# EAGLE design eib_v1.0 (EAGLE 5.06)
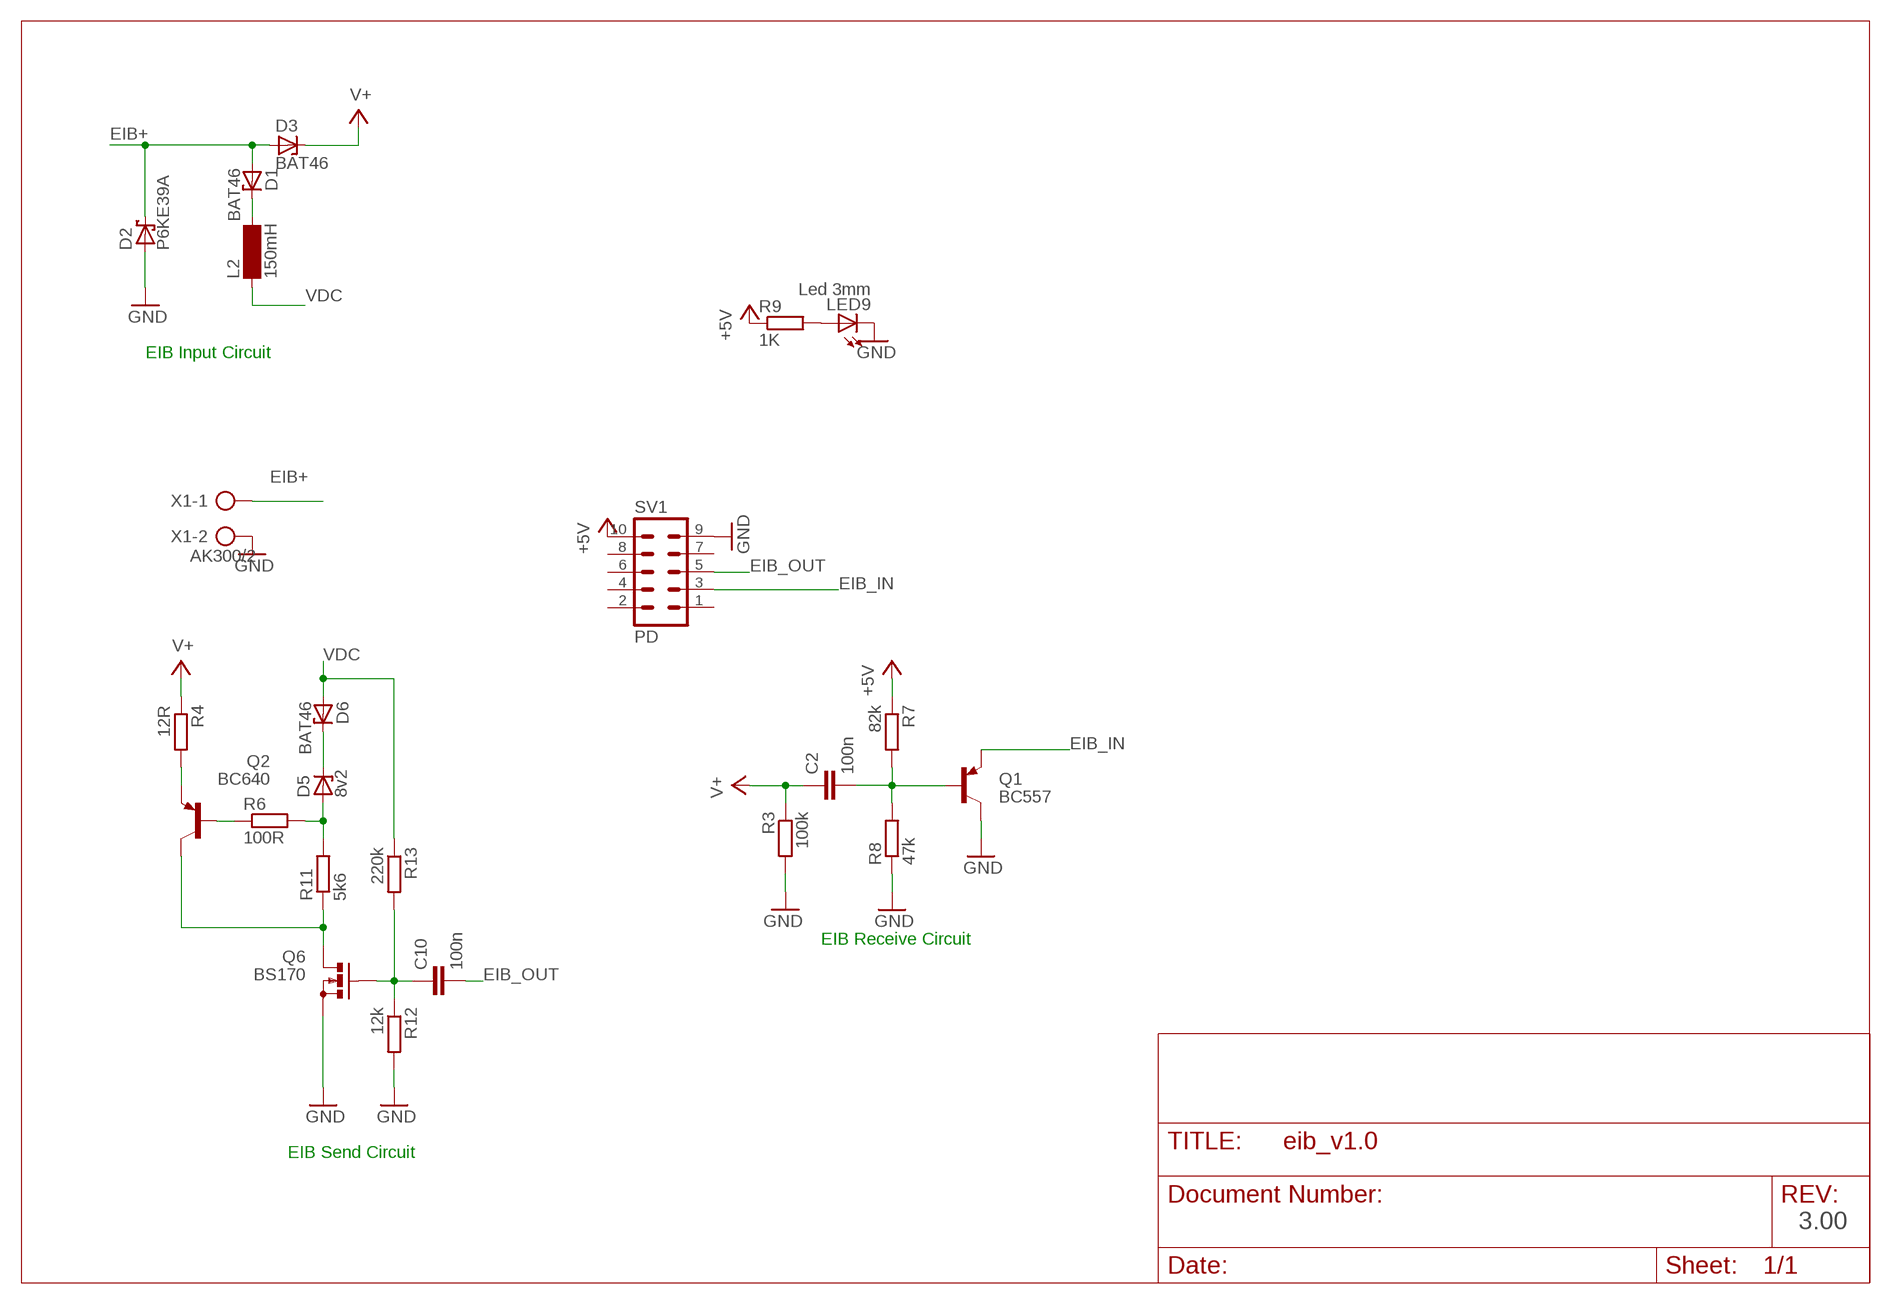
[diagram p0: schematic, sheet 1]

## Parts
C2  100n  C-EU050-025X075  [C050-025X075]
C10  100n  C-EU050-025X075  [C050-025X075]
D1  BAT46  1N821  [DO35Z10]
D2  P6KE39A  P6KEXXA  [C1702-15]
D3  BAT46  1N821  [DO35Z10]
D5  8v2  BZX90  [DO34Z7]
D6  BAT46  1N821  [DO35Z10]
L2  150mH  SD12-1000  [SD12_1000]
LED9  Led 3mm  LED3MM  [LED3MM]
Q1  BC557  [TO92]
Q2  BC640  [TO92-BCE]
Q6  BS170  [SOT54E]
R3  100k  R-EU_0207/10  [0207/10]
R4  12R  R-EU_0204/7  [0204/7]
R6  100R  R-EU_0204/2V  [0204V]
R7  82k  R-EU_0204/5  [0204/5]
R8  47k  R-EU_0204/2V  [0204V]
R9  1K  R-EU_0204/2V  [0204V]
R11  5k6  R-EU_0204/2V  [0204V]
R12  12k  R-EU_0204/7  [0204/7]
R13  220k  R-EU_0204/7  [0204/7]
SV1  PD  ML10  [ML10]
X1  AK300/2  [AK300/2]

## Nets
+5V: R7.1 R9.1 SV1.10
EIB+: D1.A D2.C D3.A X1.1
EIB_IN: Q1.1(E) SV1.3
EIB_OUT: C10.2 SV1.5
GND: D2.A LED9.K(C) Q1.3(C) Q6.S R3.2 R8.1 R12.2 SV1.9 X1.2
N$1: Q2.E R4.2
N$2: D5.C D6.C
N$3: C10.1 Q6.G R12.1 R13.2
N$4: Q2.B R6.1
N$5: Q2.C Q6.D R11.1
N$6: D1.C L2.2
N$7 [supply]: C2.2 Q1.2(B) R7.2 R8.2
N$10: D5.A R6.2 R11.2
N$25: LED9.A R9.2
V+: C2.1 D3.C R3.1 R4.1
VDC [supply]: D6.A L2.1 R13.1
Unconnected: SV1.1 SV1.2 SV1.4 SV1.6 SV1.7 SV1.8

## Notes on the sheet
- EIB Input Circuit
- EIB Receive Circuit
- EIB Send Circuit
- 3.00

## Library data of the parts
C2 C10 = rcl:C-EU: CAPACITOR, European symbol
D1 D3 D6 = diode:1N821: Reference DIODE temperature compensated, 6,2 V
D2 = diode:P6KEXXA: DIODE transient-voltage suppressor
D5 = diode:BZX90: Z DIODE
L2 = inductor-neosid:SD12: INDUCTOR nominal inductance
LED9 = led:LED: LED OSRAM: - CHIPLED LG R971, LG N971, LY N971, LG Q971, LY Q971, LO R971, LY R971 LH N974, LH R974 LS Q976, LO Q976, LY Q976 LO Q996 - Hyper CHIPLED LW Q18S LB Q993, LB Q99A, LB R99A - SideLED LS A670, LO A670, LY A670, LG A670, LP A670 LB A673, LV A673, LT A673, LW A673 LH A674 LY A675 LS A676, LA A676, LO A676, LY A676, LW A676 LS A679, LY A679, LG A679 - Hyper Micro SIDELED® LS Y876, LA Y876, LO Y876, LY Y876 LT Y87S - SmartLED LW L88C, LW L88S LB L89C, LB L89S, LG L890 LS L89K, LO L89K, LY L89K LS L896, LA L896, LO L896, LY L896 - TOPLED LS T670, LO T670, LY T670, LG T670, LP T670 LSG T670, LSP T670, LSY T670, LOP T670, LYG T670 LG T671, LOG T671, LSG T671 LB T673, LV T673, LT T673, LW T673 LH T674 LS T676, LA T676, LO T676, LY T676, LB T676, LH T676, LSB T676, LW T676 LB T67C, LV T67C, LT T67C, LS T67K, LO T67K, LY T67K, LW E67C LS E67B, LA E67B, LO E67B, LY E67B, LB E67C, LV E67C, LT E67C LW T67C LS T679, LY T679, LG T679 LS T770, LO T770, LY T770, LG T770, LP T770 LB T773, LV T773, LT T773, LW T773 LH T774 LS E675, LA E675, LY E675, LS T675 LS T776, LA T776, LO T776, LY T776, LB T776 LHGB T686 LT T68C, LB T68C - Hyper Mini TOPLED® LB M676 - Mini TOPLED Santana® LG M470 LS M47K, LO M47K, LY M47K Source: http://www.osram.convergy.de LUXEON: - LUMILED® LXK2-PW12-R00, LXK2-PW12-S00, LXK2-PW14-U00, LXK2-PW14-V00 LXK2-PM12-R00, LXK2-PM12-S00, LXK2-PM14-U00 LXK2-PE12-Q00, LXK2-PE12-R00, LXK2-PE12-S00, LXK2-PE14-T00, LXK2-PE14-U00 LXK2-PB12-K00, LXK2-PB12-L00, LXK2-PB12-M00, LXK2-PB14-N00, LXK2-PB14-P00, LXK2-PB14-Q00 LXK2-PR12-L00, LXK2-PR12-M00, LXK2-PR14-Q00, LXK2-PR14-R00 LXK2-PD12-Q00, LXK2-PD12-R00, LXK2-PD12-S00 LXK2-PH12-R00, LXK2-PH12-S00 LXK2-PL12-P00, LXK2-PL12-Q00, LXK2-PL12-R00 Source: www.luxeon.com KINGBRIGHT: KA-3528ASYC Source: www.kingbright.com
Q1 = transistor-pnp:BC557: PNP Transistor
Q2 = transistor-pnp:BC640*: PNP Transistror
Q6 = transistor-small-signal:BS170: N-CHANNEL MOS FET
R3 R4 R6-R9 R11-R13 = rcl:R-EU_: RESISTOR, European symbol
SV1 = con-harting-ml:ML10: HARTING
X1 = con-ptr500:AK300/2: CONNECTOR

## Net classes
1 supply: width 0.406 mm

## Board
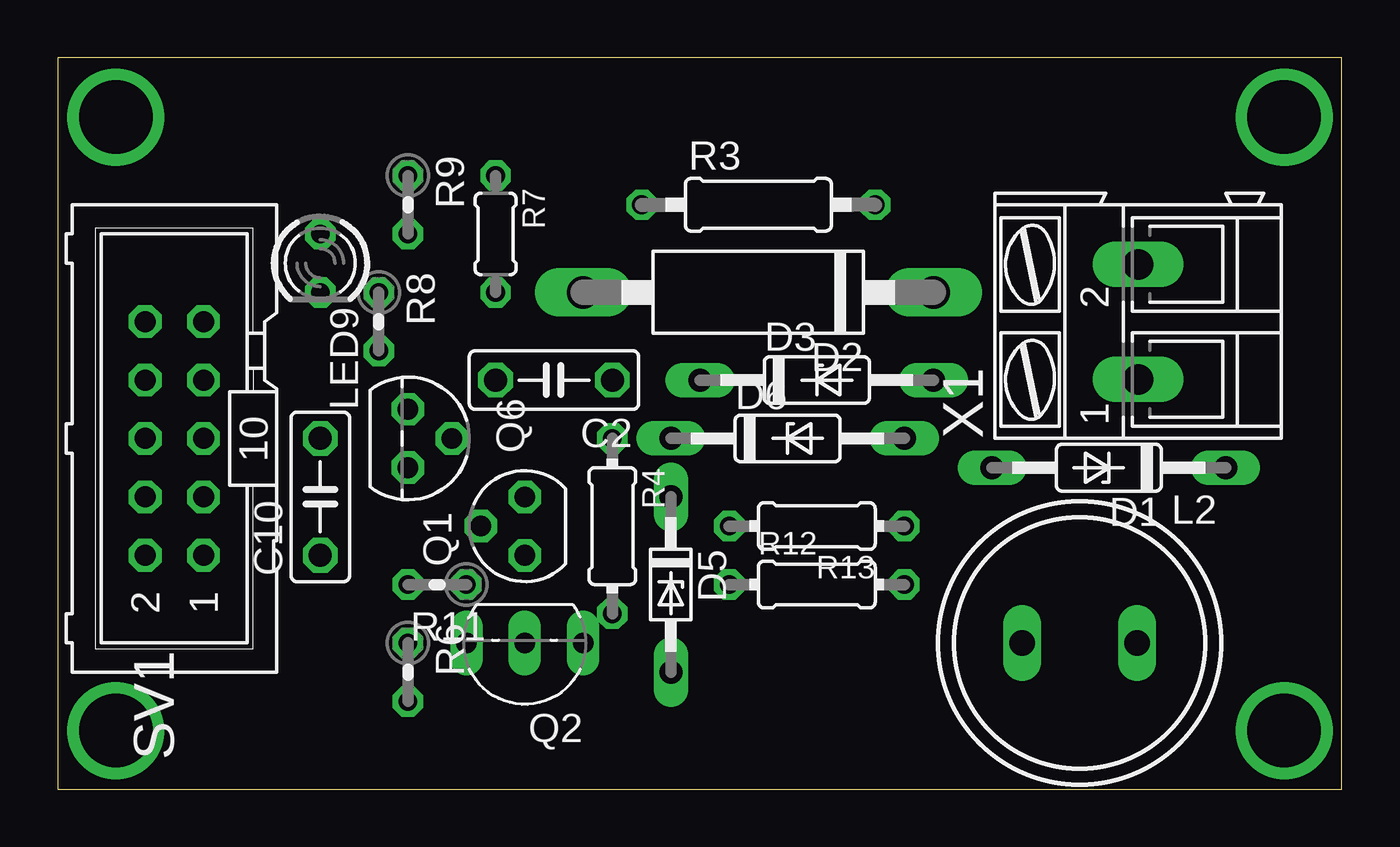
[diagram p1: board, top side]
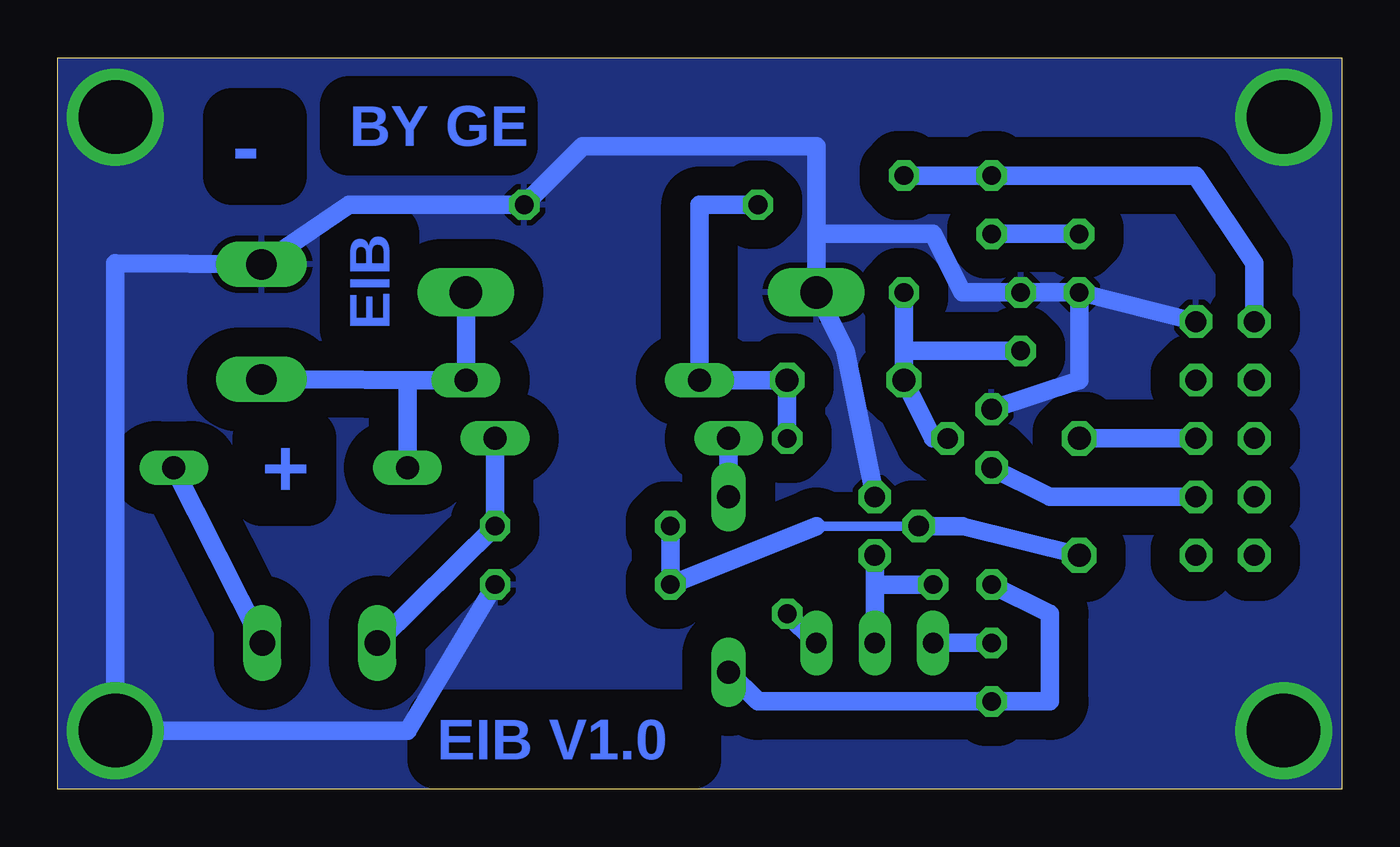
[diagram p2: board, bottom side, seen from below]

Size 55.86 x 31.8 mm. Coordinates in mm from the lower left corner, seen from the top.
Outline: 0,0 55.86,0 55.86,31.8 0,31.8 0,0
Copper layers (1*16): Top 0.035mm / dielectric 1.5mm / Bottom 0.035mm
Design rules "0.35mm": minimum track width 10mil, minimum drill 24mil, track to track 0.35mm, track to pad 0.35mm, pad to pad 0.35mm, via to via 0.35mm, smd to smd 0.35mm, copper to edge 0mil, drill to drill 8mil, minimum pad ring 10mil, minimum via ring 8mil, stop-mask expansion 4mil, vias tented up to drill 0mil, thermal gap 10mil

### Footprints (pad centres in the part's own frame; a part is rotated, then mirrored left to right if it is on the bottom)
C050-025X075 = drill 1 octagon: 1 -2.54,0; 2 2.54,0
DO35Z10 = drill 1 long: A 5.08,0; C -5.08,0
C1702-15 = drill 1.4 long: A 7.62,0; C -7.62,0
DO34Z7 = drill 1 long: A 3.81,0; C -3.81,0
SD12_1000 = drill 1.1 long: 1 -2.5,0; 2 2.5,0
LED3MM = drill 0.813 octagon: A -1.27,0; K 1.27,0
TO92 = drill 0.9 octagon: 1 1.27,0; 2 0,1.905; 3 -1.27,0
TO92-BCE = drill 0.9 long: B 2.54,0; C 0,0; E -2.54,0
SOT54E = drill 0.9 octagon: D -1.27,0; G 0,1.905; S 1.27,0
0207/10 = drill 0.813 octagon: 1 -5.08,0; 2 5.08,0
0204/7 = drill 0.813 octagon: 1 -3.81,0; 2 3.81,0
0204V = drill 0.813 octagon: 1 -1.27,0; 2 1.27,0
0204/5 = drill 0.813 octagon: 1 -2.54,0; 2 2.54,0
ML10 = drill 0.914 octagon: 1 -5.08,-1.27; 2 -5.08,1.27; 3 -2.54,-1.27; 4 -2.54,1.27; 5 0,-1.27; 6 0,1.27; 7 2.54,-1.27; 8 2.54,1.27; 9 5.08,-1.27; 10 5.08,1.27
AK300/2 = drill 1.321 long: 1 -2.515,0; 2 2.489,0

### Placement (x,y rotation side)
C2  21.59,17.78 180 top
C10  11.43,12.7 90 top
D1  45.72,13.97 180 top
D2  30.48,21.59 180 top
D3  33.02,17.78 0 top
D5  26.67,8.89 270 top
D6  31.75,15.24 0 top
L2  44.45,6.35 0 top
LED9  11.43,22.86 270 top
Q1  15.24,15.24 270 top
Q2  20.32,6.35 180 top
Q6  20.32,11.43 90 top
R3  30.48,25.4 0 top
R4  24.13,11.43 270 top
R6  15.24,5.08 270 top
R7  19.05,24.13 270 top
R8  13.97,20.32 270 top
R9  15.24,25.4 270 top
R11  16.51,8.89 180 top
R12  33.02,8.89 0 top
R13  33.02,11.43 180 top
SV1  5.08,15.24 90 top
X1  46.99,20.32 90 top

### Tracks (layer width: path | path; a pad name or v marks a point on that pad's centre or on a via)
+5V
  Bottom 0.813: SV1.10 3.81,22.86 6.35,26.67 R9.1 R7.1
EIB+
  Bottom 0.813: D3.A D2.C D3.A | D3.A X1.1 | D1.A 40.64,17.78 D3.A
EIB_IN
  Bottom 0.813: Q1.1 12.7,12.7 SV1.3
EIB_OUT
  Bottom 0.813: SV1.5 C10.2
GND  (via drill 3.2)
  Bottom 0.813: SV1.9 LED9.K | LED9.K R8.1 16.51,21.59 17.78,24.13 22.86,24.13 | Q1.3 11.43,17.78 LED9.K | 22.86,24.13 22.86,27.94 33.02,27.94 R3.2 43.18,25.4 X1.2 53.34,22.86 v53.34,2.54 40.64,2.54 R12.2 | Q6.S 21.59,19.05 D2.A 22.86,24.13
  other vias: 53.34,29.21 2.54,29.21 2.54,2.54
  pour Bottom (isolate 1.27): 0,0 55.88,0 55.88,31.75 0,31.75
N$1
  Bottom 0.813: Q2.E R4.2
N$2
  Bottom 0.813: D5.C D6.C
N$3
  Bottom 0.406: Q6.G 22.86,11.43
  Bottom 0.813: C10.1 16.51,11.43 Q6.G | R12.1 R13.2 R12.1 | 22.86,11.43 R12.1
N$4
  Bottom 0.813: R6.1 Q2.B
N$5
  Bottom 0.813: 20.32,8.89 Q2.C | 20.32,8.89 Q6.D | R11.1 20.32,8.89
N$6
  Bottom 0.813: L2.2 D1.C
N$7
  Bottom 0.813: 19.05,19.05 R7.2 | R8.2 19.05,19.05 | 19.05,19.05 C2.2 17.78,15.24 Q1.2
N$10
  Bottom 0.813: R11.2 12.7,7.62 12.7,3.81 R6.2 25.4,3.81 D5.A
N$25
  Bottom 0.813: LED9.A R9.2
V+
  Bottom 0.813: R3.1 27.94,25.4 D3.C C2.1 R4.1
VDC
  Bottom 0.813: L2.1 R13.1 D6.A

### Text on the board
Bottom: BY GE | - | EIB | + | EIB V1.0